# EAGLE design cnc_shield (EAGLE 7.5.0)
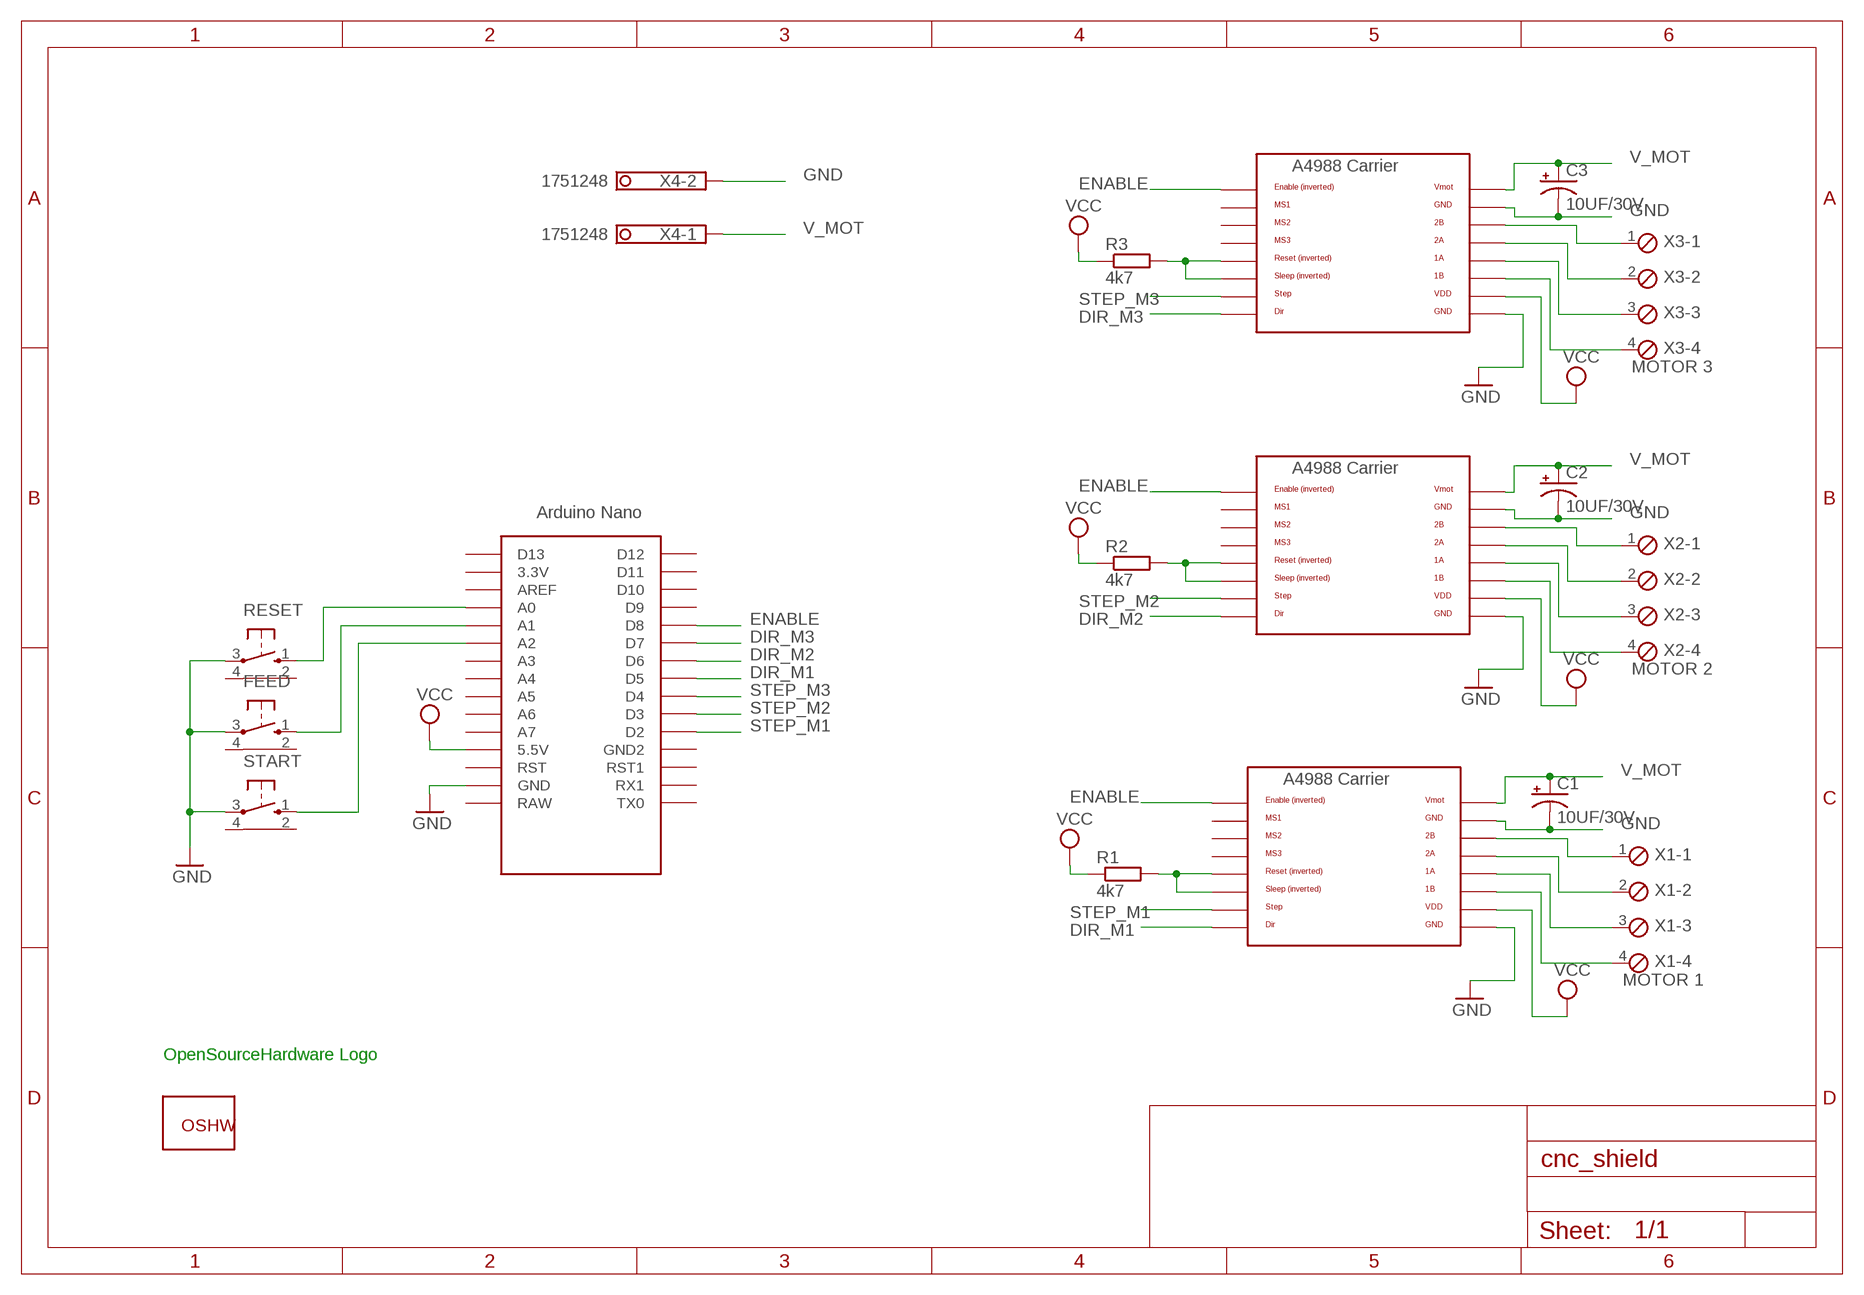
[diagram p0: schematic, sheet 1]

## Parts
C1  10UF/30V  CPOL-USE2.5-6  [E2,5-6]
C2  10UF/30V  CPOL-USE2.5-6  [E2,5-6]
C3  10UF/30V  CPOL-USE2.5-6  [E2,5-6]
FEED  10-XX-RPAD  [B3F-10XX-RPAD]
GOLD_ORB_SM1  OSHWLOGO_GOLD_ORB_SM  [OSHW2]
R1  4k7  R-EU_0204/5  [0204/5]
R2  4k7  R-EU_0204/5  [0204/5]
R3  4k7  R-EU_0204/5  [0204/5]
RESET  10-XX-RPAD  [B3F-10XX-RPAD]
START  10-XX-RPAD  [B3F-10XX-RPAD]
U$1  NANO  [NANO]
U$2  A4988BREAKOUT  [A4988BREAKOUT]
U$3  A4988BREAKOUT  [A4988BREAKOUT]
U$4  A4988BREAKOUT  [A4988BREAKOUT]
X1  MOTOR 1  MPT4  [4POL254]
X2  MOTOR 2  MPT4  [4POL254]
X3  MOTOR 3  MPT4  [4POL254]
X4  1751248  [1751248]

## Nets
DIR_M1: U$1.D5 U$4.DIR
DIR_M2: U$1.D6 U$2.DIR
DIR_M3: U$1.D7 U$3.DIR
ENABLE: U$1.D8 U$2.EN U$3.EN U$4.EN
GND: C1.- C2.- C3.- FEED.3(P) RESET.3(P) START.3(P) U$1.GND U$2.GND U$2.GND@0(GND) U$3.GND U$3.GND@0(GND) U$4.GND U$4.GND@0(GND) X4.2
N$1: U$2.2B X2.1
N$2: R1.2 U$4.RST U$4.SLP(SLEEP)
N$3: U$4.2B X1.1
N$4: U$4.2A X1.2
N$5: U$4.1A X1.3
N$6: U$2.2A X2.2
N$7: U$4.1B X1.4
N$8: U$2.1A X2.3
N$9: U$2.1B X2.4
N$10: R2.2 U$2.RST U$2.SLP(SLEEP)
N$11: U$3.2B X3.1
N$12: U$3.2A X3.2
N$13: U$3.1A X3.3
N$14: U$3.1B X3.4
N$15: R3.2 U$3.RST U$3.SLP(SLEEP)
N$16: RESET.1(S) U$1.A0
N$17: FEED.1(S) U$1.A1
N$18: START.1(S) U$1.A2
STEP_M1: U$1.D2 U$4.STEP
STEP_M2: U$1.D3 U$2.STEP
STEP_M3: U$1.D4 U$3.STEP
V_MOT: C1.+ C2.+ C3.+ U$2.VMOT U$3.VMOT U$4.VMOT X4.1
VCC: R1.1 R2.1 R3.1 U$1.5V(5.5V) U$2.VDD U$3.VDD U$4.VDD
Unconnected: FEED.2(GND1) FEED.4(GND2) RESET.2(GND1) RESET.4(GND2) START.2(GND1) START.4(GND2) U$1.3.3V U$1.A3 U$1.A4 U$1.A5 U$1.A6 U$1.A7 U$1.AREF U$1.D9 U$1.D10 U$1.D11 U$1.D12 U$1.D13 U$1.GND1(GND2) U$1.ICSP1 U$1.ICSP2 U$1.ICSP3 U$1.ICSP4 U$1.ICSP5 U$1.ICSP6 U$1.RAW U$1.RST U$1.RST1 U$1.RX1 U$1.TX0 U$2.MS1 U$2.MS2 U$2.MS3 U$3.MS1 U$3.MS2 U$3.MS3 U$4.MS1 U$4.MS2 U$4.MS3

## Notes on the sheet
- OpenSourceHardware Logo

## Library data of the parts
C1-C3 = rcl:CPOL-US: POLARIZED CAPACITOR, American symbol
FEED RESET START = RepRapjr:10-XX-RPAD: OMRON SWITCH
GOLD_ORB_SM1 = NBitWonder:OSHWLOGO: These are Open-Source Hardware logos.
R1-R3 = rcl:R-EU_: RESISTOR, European symbol
U$1 = Arduino-clone:NANO: Arduino Nano
U$2-U$4 = RepRapjr:A4988BREAKOUT
X1-X3 = con-phoenix-254:MPT4: PHOENIX CONNECTOR; OC_FARNELL: unknown; OC_NEWARK: unknown
X4 = con-phoenix-350:1751248: MKDS 1/ 2-3,5 Printklemme Nennstrom: 10 A Bemessungsspannung: 160 V Raster: 3,5 mm Polzahl: 2 Montageart: Löten Anschlussart: Schraubanschluss Anschlussrichtung vom Leiter zur Platine: 0° Source: http://eshop.phoenixcontact.com .. 1751248.pdf; OC_FARNELL: unknown; OC_NEWARK: unknown

## Board
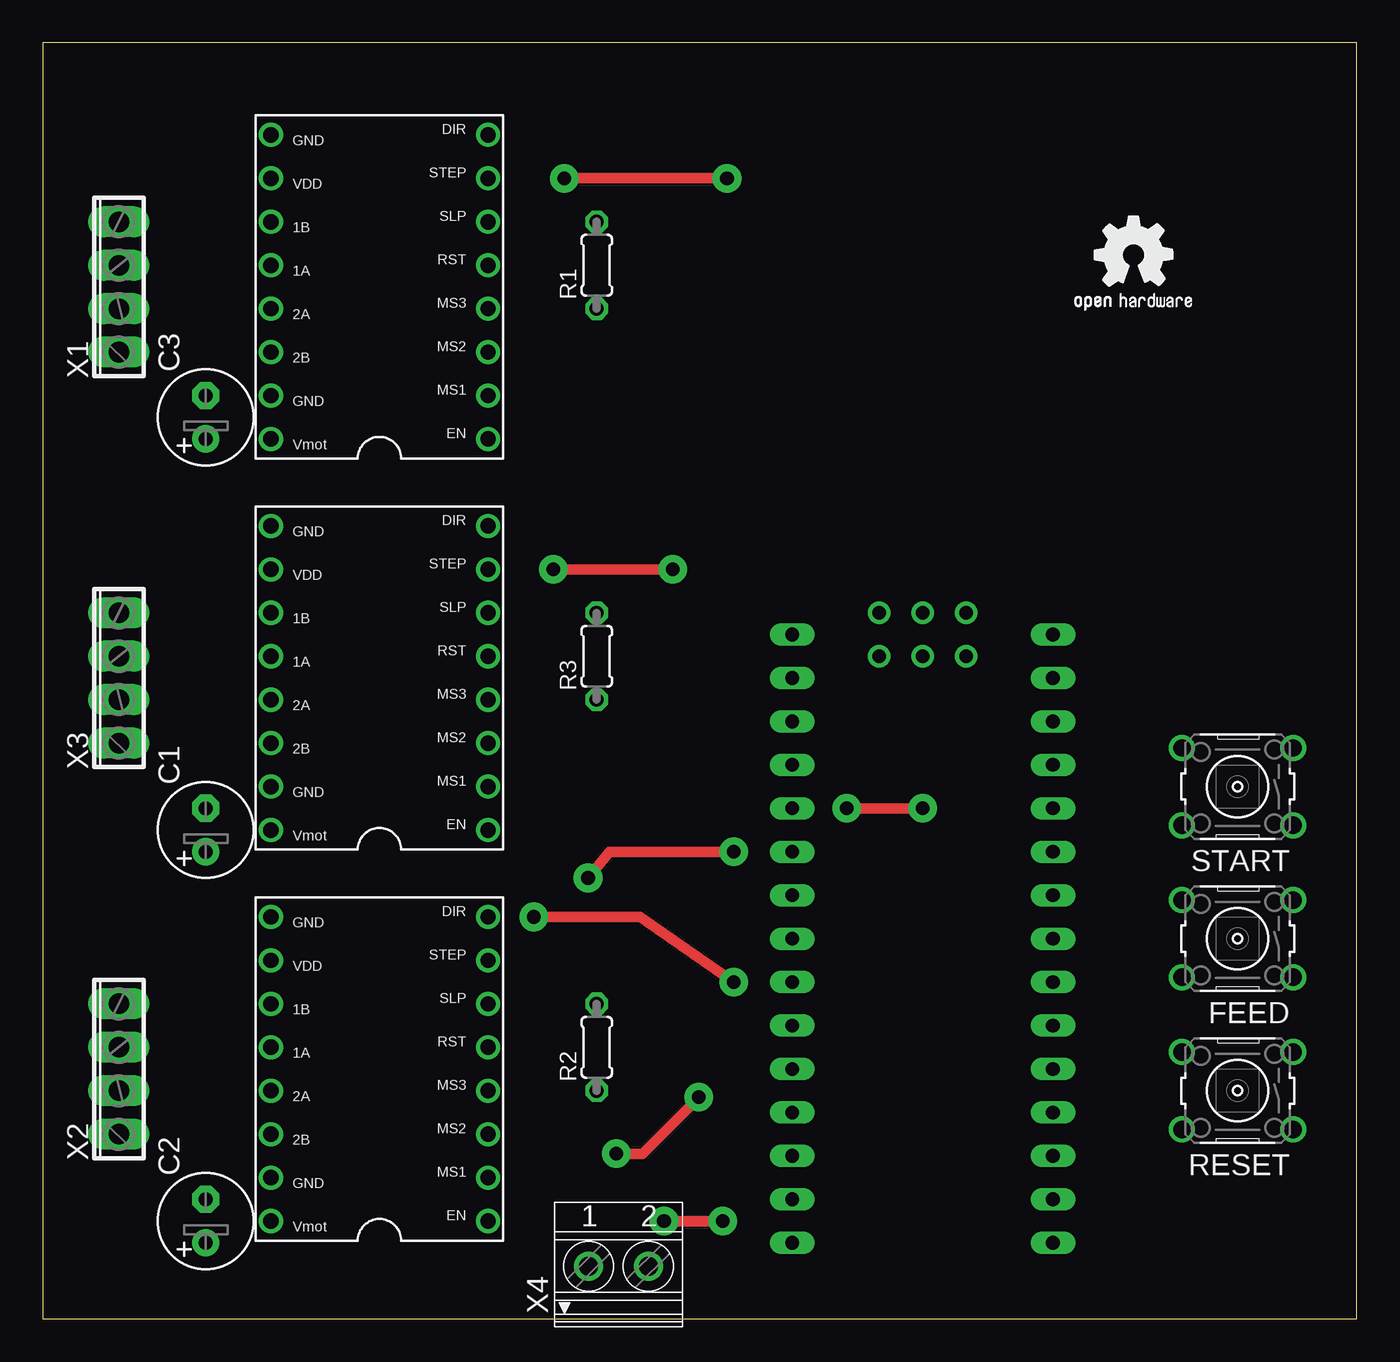
[diagram p1: board, top side]
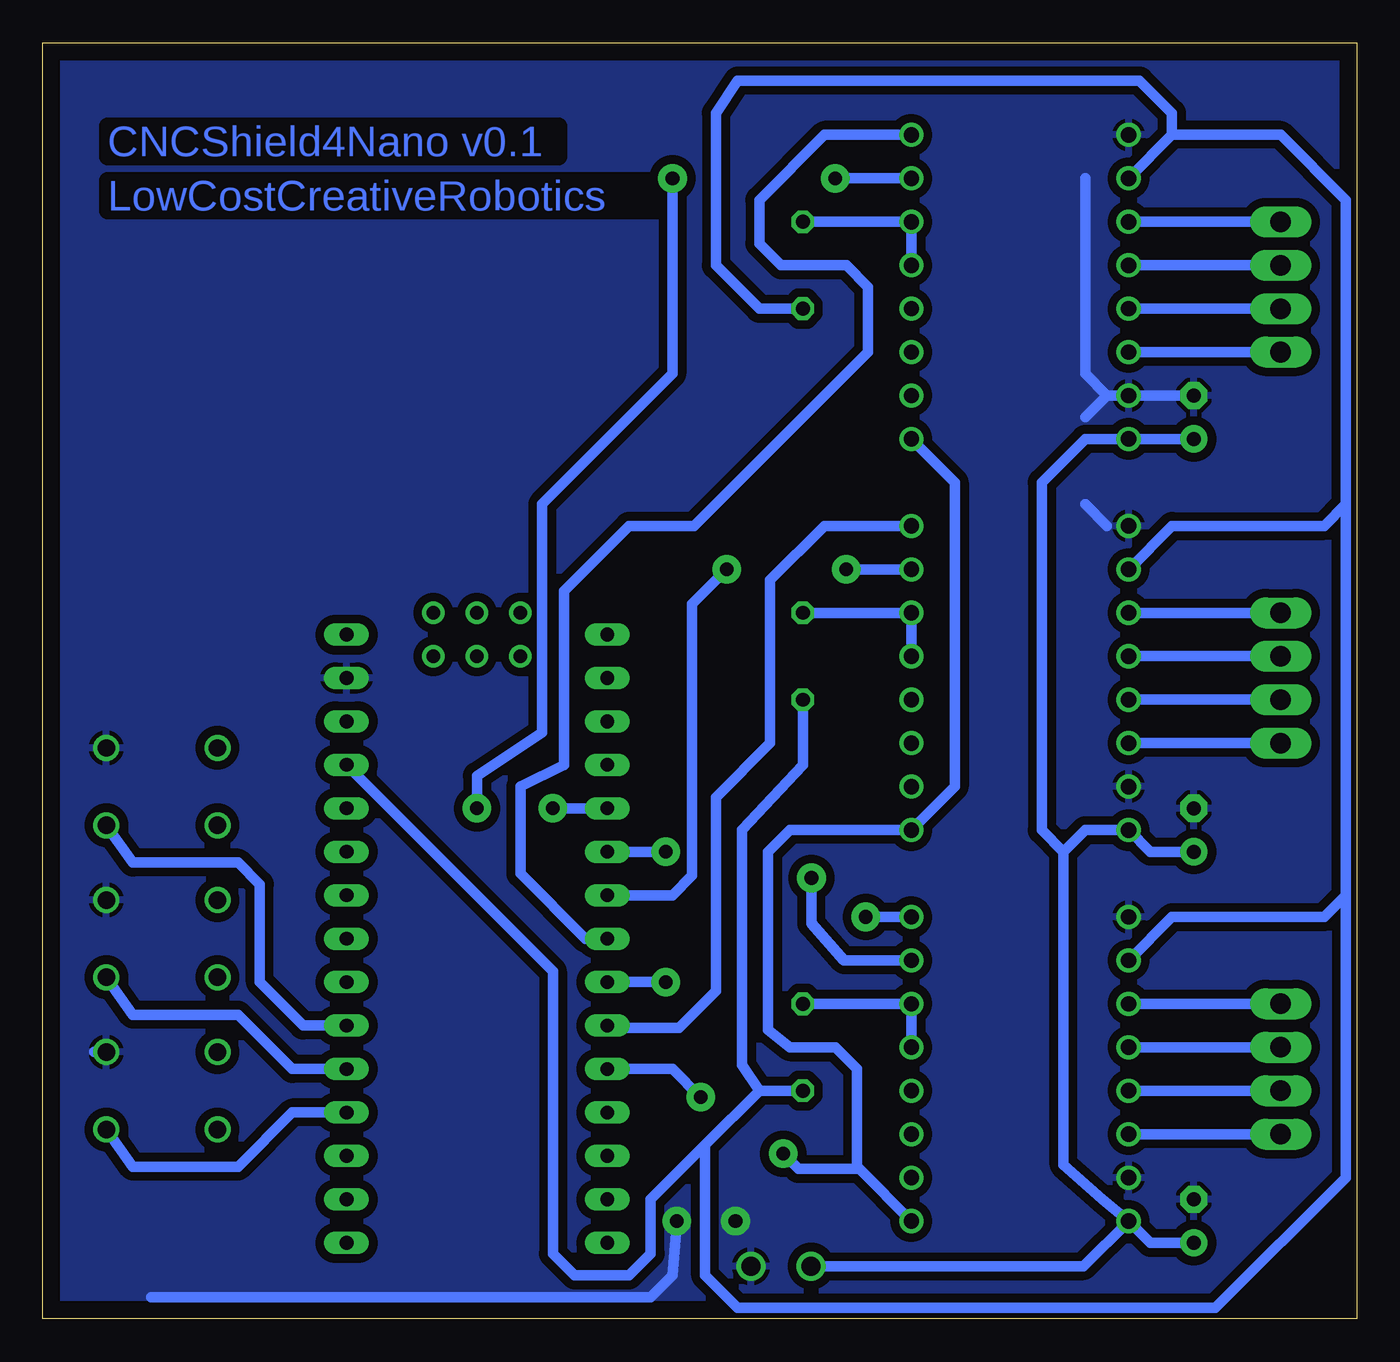
[diagram p2: board, bottom side, seen from below]

Size 76.81 x 74.6 mm. Coordinates in mm from the lower left corner, seen from the top.
Outline: 0,0 76.81,0 76.81,74.6 0,74.6 0,0
Copper layers (1*16): Top 0.035mm / dielectric 1.5mm / Bottom 0.035mm
Design rules "default": minimum track width 10mil, minimum drill 24mil, track to track 8mil, track to pad 8mil, pad to pad 8mil, via to via 8mil, smd to smd 8mil, copper to edge 40mil, drill to drill 8mil, minimum pad ring 10mil, minimum via ring 8mil, stop-mask expansion 4mil, vias tented up to drill 0mil, thermal gap 10mil

### Footprints (pad centres in the part's own frame; a part is rotated, then mirrored left to right if it is on the bottom)
E2,5-6 = drill 0.813 pad 1.6: + -1.27,0 | drill 0.813 pad 1.6 octagon: - 1.27,0
B3F-10XX-RPAD = drill 1.016: 1 -3.251,2.261; 2 3.251,2.261; 3 -3.251,-2.261; 4 3.251,-2.261
0204/5 = drill 0.813 octagon: 1 -2.54,0; 2 2.54,0
NANO = drill 0.8 long: 3.3V -10.16,24.13; 5V -10.16,-1.27; A0 -10.16,19.05; A1 -10.16,16.51; A2 -10.16,13.97; A3 -10.16,11.43; A4 -10.16,8.89; A5 -10.16,6.35; A6 -10.16,3.81; A7 -10.16,1.27; AREF -10.16,21.59; D2 5.08,1.27; D3 5.08,3.81; D4 5.08,6.35; D5 5.08,8.89; D6 5.08,11.43; D7 5.08,13.97; D8 5.08,16.51; D9 5.08,19.05; D10 5.08,21.59; D11 5.08,24.13; D12 5.08,26.67; D13 -10.16,26.67; GND -10.16,-6.35; GND1 5.08,-1.27; RAW -10.16,-8.89; RST -10.16,-3.81; RST1 5.08,-3.81; RX1 5.08,-6.35; TX0 5.08,-8.89 | drill 0.8: ICSP1 -5.08,-10.16; ICSP2 -5.08,-7.62; ICSP3 -2.54,-10.16; ICSP4 -2.54,-7.62; ICSP5 0,-10.16; ICSP6 0,-7.62
A4988BREAKOUT = drill 0.9: 1A 8.89,1.27; 1B 11.43,1.27; 2A 6.35,1.27; 2B 3.81,1.27; DIR 16.51,-11.43; EN -1.27,-11.43; GND 16.51,1.27; GND@0 1.27,1.27; MS1 1.27,-11.43; MS2 3.81,-11.43; MS3 6.35,-11.43; RST 8.89,-11.43; SLP 11.43,-11.43; STEP 13.97,-11.43; VDD 13.97,1.27; VMOT -1.27,1.27
4POL254 = drill 1.2 long: 1 -3.81,0; 2 -1.27,0; 3 1.27,0; 4 3.81,0
1751248 = drill 1.1 pad 1.7: 1 -1.75,-0.1; 2 1.75,-0.1

### Placement (x,y rotation side)
C1  9.53,28.57 90 top
C2  9.53,5.71 90 top
C3  9.53,52.7 90 top
FEED  69.85,22.23 180 top
GOLD_ORB_SM1  59.94,57.91 0 top
R1  32.38,61.59 90 top
R2  32.38,15.88 90 top
R3  32.38,38.73 90 top
RESET  69.85,13.34 180 top
START  69.85,31.11 180 top
U$1  48.9,31.11 180 top
U$2  14.61,6.99 90 top
U$3  14.61,29.84 90 top
U$4  14.61,52.7 90 top
X1  4.45,60.33 90 top
X2  4.45,14.61 90 top
X3  4.45,37.47 90 top
X4  33.66,3.17 0 top

### Tracks (layer width: path | path; a pad name or v marks a point on that pad's centre or on a via)
DIR_M1
  Bottom 0.61: U$4.DIR 31.11,69.22 34.92,65.41 34.92,62.87 33.66,61.59 29.84,61.59 28.57,60.33 28.57,56.52 38.73,46.35 42.55,46.35 46.35,42.55 46.35,32.38 48.9,31.11 48.9,26.04 45.09,22.23 U$1.D5
DIR_M2  (via drill 0.8 pad 1.68)
  Top 0.61: v28.7,23.5 34.92,23.5 v40.39,19.68
  Bottom 0.61: U$2.DIR v28.7,23.5 | v40.39,19.68 U$1.D6
DIR_M3
  Bottom 0.61: U$3.DIR 31.11,46.35 34.29,43.18 34.29,33.66 37.47,30.48 37.47,19.18 39.62,17.02 43.69,17.02 U$1.D7
ENABLE  (via drill 0.8 pad 1.68)
  Top 0.61: v38.35,12.95 35.05,9.65 v33.53,9.65
  Bottom 0.61: U$4.EN 23.5,48.9 23.5,31.11 U$3.EN 33.15,28.57 34.42,27.3 34.42,16.89 33.15,15.88 30.48,15.88 29.21,14.61 29.21,8.89 29.08,8.76 | 29.08,8.76 U$2.EN | U$1.D8 40.01,14.61 v38.35,12.95 | v33.53,9.65 32.64,8.76 29.08,8.76
GND  (via drill 0.8 pad 1.68)
  Top 0.61: v36.32,5.71 v39.75,5.71
  Bottom 0.61: C3.- U$4.GND@0 14.61,53.98 | 15.88,47.62 14.61,46.35 | 15.88,66.67 15.88,55.24 14.61,53.98 | 14.61,53.98 15.88,52.7 | v39.75,5.71 40.01,2.54 41.27,1.27 70.48,1.27 | 73.81,15.6 RESET.3 | 73.56,24.49 FEED.3
  pour Bottom (isolate 0.508): 0,0 76.83,0 76.83,74.3 0,74.3
N$1
  Bottom 0.61: X2.1 U$2.2B
N$2
  Bottom 0.61: R1.2 U$4.SLP U$4.RST
N$3
  Bottom 0.61: X1.1 U$4.2B
N$4
  Bottom 0.61: X1.2 U$4.2A
N$5
  Bottom 0.61: X1.3 U$4.1A
N$6
  Bottom 0.61: X2.2 U$2.2A
N$7
  Bottom 0.61: X1.4 U$4.1B
N$8
  Bottom 0.61: X2.3 U$2.1A
N$9
  Bottom 0.61: X2.4 U$2.1B
N$10
  Bottom 0.61: R2.2 U$2.SLP U$2.RST
N$11
  Bottom 0.61: X3.1 U$3.2B
N$12
  Bottom 0.61: X3.2 U$3.2A
N$13
  Bottom 0.61: X3.3 U$3.1A
N$14
  Bottom 0.61: X3.4 U$3.1B
N$15
  Bottom 0.61: U$3.RST U$3.SLP R3.2
N$16
  Bottom 0.61: U$1.A0 62.23,12.06 65.41,8.89 71.55,8.89 RESET.1
N$17
  Bottom 0.61: U$1.A1 62.23,14.61 65.41,17.78 71.55,17.78 FEED.1
N$18
  Bottom 0.61: U$1.A2 61.59,17.14 64.14,19.68 64.14,25.4 65.41,26.67 71.55,26.67 START.1
STEP_M1  (via drill 0.8 pad 1.68)
  Top 0.61: v30.48,66.67 v40.01,66.67 | v51.44,29.84 v46.99,29.84
  Bottom 0.61: U$4.STEP v30.48,66.67 | v51.44,29.84 51.44,31.75 47.62,34.29 47.62,47.62 40.01,55.24 v40.01,66.67 | v46.99,29.84 U$1.D2
STEP_M2  (via drill 0.8 pad 1.68)
  Top 0.61: v31.88,25.78 33.15,27.3 v40.39,27.3
  Bottom 0.61: U$2.STEP 29.97,20.95 31.88,23.11 v31.88,25.78 | v40.39,27.3 U$1.D3
STEP_M3  (via drill 0.8 pad 1.68)
  Top 0.61: v29.84,43.81 v36.83,43.81
  Bottom 0.61: U$3.STEP v29.84,43.81 | U$1.D4 40.01,24.77 38.86,25.91 38.86,41.78 v36.83,43.81
V_MOT
  Bottom 0.61: X4.1 15.97,3.08 U$2.VMOT | U$2.VMOT 12.06,4.45 C2.+ | C1.+ 12.06,27.3 U$3.VMOT 15.88,28.57 17.14,27.3 | C3.+ U$4.VMOT 15.88,51.44 18.41,48.9 18.41,28.57 17.14,27.3 | 17.14,27.3 17.14,9.02 14.86,6.99 U$2.VMOT
VCC
  Bottom 0.61: U$4.VDD 10.79,69.22 | 10.79,69.22 10.79,70.48 12.7,72.39 36.2,72.39 37.47,70.48 37.47,61.59 34.92,59.05 R1.1 | U$3.VDD 10.79,46.35 1.91,46.35 0.64,47.62 | 0.64,47.62 0.64,65.41 4.45,69.22 10.79,69.22 | 0.64,24.77 0.64,47.62 | U$2.VDD 10.79,23.5 1.91,23.5 0.64,24.77 | 0.64,24.77 0.64,8.26 8.26,0.64 36.2,0.64 38.1,2.54 38.1,10.16 | R3.1 32.38,32.38 35.94,28.57 35.94,14.86 34.92,13.34 | U$1.5V 46.99,20.32 46.99,3.81 45.72,2.54 42.55,2.54 41.27,3.81 41.27,6.99 38.1,10.16 | R2.1 34.92,13.34 | 34.92,13.34 38.1,10.16

### Text on the board
Bottom: CNCShield4Nano v0.1 | LowCostCreativeRobotics
tValues: CNCShield4Nano